# Altium schematic sheet Main.SchDoc
size A4; SheetNumber: 1; SheetTotal: 3
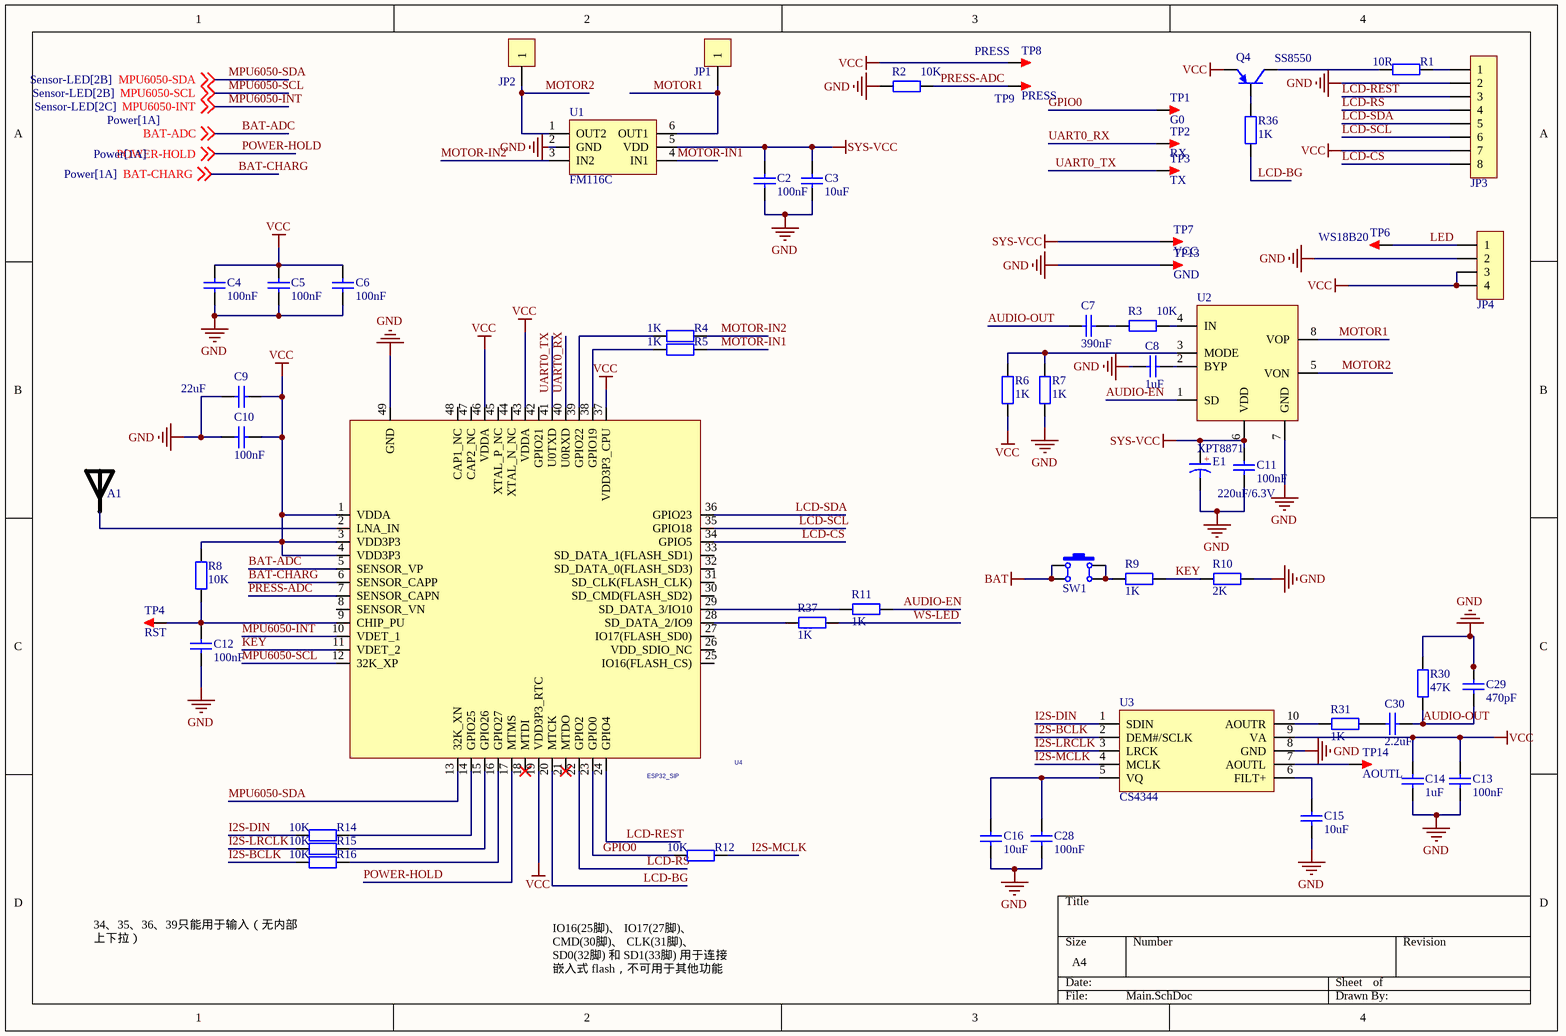
[diagram p0: Main.SchDoc]

## Parts
A1  RAINSUN  [ANT-Rainsun-AN5120]  (value not drawn)
C2  100nF  [C0402_M]
C3  10uF  [C0402_M]
C4  100nF  [C0402_M]
C5  100nF  [C0402_M]
C6  100nF  [C0402_M]
C7  390nF  [C0402_M]
C8  1uF  [C0402_M]
C9  22uF  [C0402_M]
C10  100nF  [C0402_M]
C11  100nF  [C0402_M]
C12  100nF  [C0402_M]
C13  100nF  [C0402_M]
C14  1uF  [C0402_M]
C15  10uF  [C0402_M]
C16  10uF  [C0402_M]
C28  100nF  [C0402_M]
C29  470pF  [C0402_M]
C30  2.2uF  [C0402_M]
E1  220uF/6.3V  [C_3528]
JP1  HDR-1x1  [HDR2.54-LI-1P]  (value not drawn)
JP2  HDR-1x1  [HDR2.54-LI-1P]  (value not drawn)
JP3  CON-8P  [FPC0.5-WT-8P-H1.0]  (value not drawn)
JP4  CON-4P  [FPC0.5-WT-4P-H1.0]  (value not drawn)
Q4  SS8550  [SOT23-3N]
R1  10R  [R0402_M]
R2  10K  [R0402_M]
R3  10K  [R0402_M]
R4  1K  [R0402_M]
R5  1K  [R0402_M]
R6  1K  [R0402_M]
R7  1K  [R0402_M]
R8  10K  [R0402_M]
R9  1K  [R0402_M]
R10  2K  [R0402_M]
R11  1K  [R0402_M]
R12  10K  [R0402_M]
R14  10K  [R0402_M]
R15  10K  [R0402_M]
R16  10K  [R0402_M]
R30  47K  [R0402_M]
R31  1K  [R0402_M]
R36  1K  [R0402_M]
R37  1K  [R0402_M]
SW1  4x4x1.5  [SW SMD-4*4*1.5]  (value not drawn)
TP1  G0  [TEST 1.2]
TP2  RX  [TEST 1.2]
TP3  TX  [TEST 1.2]
TP4  RST  [TEST 1.2]
TP6  WS18B20  [TEST 1.2]
TP7  VCC  [TEST 1.2]
TP8  PRESS  [TEST 1.2]
TP9  PRESS  [TEST 1.2]
TP13  GND  [TEST 1.2]
TP14  AOUTL  [TEST 1.2]
U1  FM116C  [SOT23-6]
U2  XPT8871  [ESOP8_L]
U3  CS4344  [TSSOP-10_L3.0-W3.0-P0.50-LS4.9-BL]
U4  ESP32_SIP  [QFN48 7X7_N]

## Nets
BAT: SW1.1 SW1.4
GND: C2.2 C3.2 C4.2 C5.2 C6.2 C8.2 C9.2 C10.2 C11.2 C12.1 C13.1 C14.1 C15.2 C16.2 C28.2 C29.1 E1.2(K) JP3.2 JP4.2 R2.1 R7.2 R10.2 R30.1 TP13.1 U1.2(GND) U2.7(GND) U3.8(GND) U4.49(GND)
SYS-VCC: C2.1 C3.1 C11.1 E1.1(A) TP7.1 U1.5(VDD) U2.6(VDD)
VCC: C4.1 C5.1 C6.1 C9.1 C10.1 C13.2 C14.2 JP3.7 JP4.3 JP4.4 Q4.2(E) R6.2 R8.2 TP8.1 U3.9(VA) U4.1(VDDA) U4.3(VDD3P3) U4.4(VDD3P3) U4.19(VDD3P3_RTC) U4.37(VDD3P3_CPU) U4.43(VDDA) U4.46(VDDA)
AUDIO-EN: R11.2 U2.1(SD)
AUDIO-OUT: C7.2 C29.2 C30.2 R30.2
BAT-ADC: U4.5(SENSOR_VP) ; off-sheet BAT-ADC
BAT-CHARG: U4.6(SENSOR_CAPP) ; off-sheet BAT-CHARG
GPIO0: R12.2 TP1.1 U4.23(GPIO0)
I2S-BCLK: R16.2 U3.2(DEM#/SCLK)
I2S-DIN: R14.2 U3.1(SDIN)
I2S-LRCLK: R15.2 U3.3(LRCK)
I2S-MCLK: R12.1 U3.4(MCLK)
KEY: R9.2 R10.1 U4.11(VDET_2)
LCD-BG: R36.2 U4.20(MTCK)
LCD-CS: JP3.8 U4.34(GPIO5)
LCD-REST: JP3.3 U4.24(GPIO4)
LCD-RS: JP3.4 U4.22(GPIO2)
LCD-SCL: JP3.6 U4.35(GPIO18)
LCD-SDA: JP3.5 U4.36(GPIO23)
LED: JP4.1 TP6.1
MOTOR1: JP1.1 U1.6(OUT1) U2.8(VOP)
MOTOR2: JP2.1 U1.1(OUT2) U2.5(VON)
MOTOR-IN1: R5.1 U1.4(IN1)
MOTOR-IN2: R4.1 U1.3(IN2)
MPU6050-INT: U4.10(VDET_1) ; off-sheet MPU6050-INT
MPU6050-SCL: U4.12(32K_XP) ; off-sheet MPU6050-SCL
MPU6050-SDA: U4.13(32K_XN) ; off-sheet MPU6050-SDA
POWER-HOLD: U4.17(MTMS) ; off-sheet POWER-HOLD
PRESS-ADC: R2.2 TP9.1 U4.7(SENSOR_CAPN)
UART0_RX: TP2.1 U4.40(U0RXD)
UART0_TX: TP3.1 U4.41(U0TXD)
WS-LED: R37.2
NetA1_1: A1.1 U4.2(LNA_IN)
NetC7_1: C7.1 R3.1
NetC8_1: C8.1 U2.2(BYP)
NetC12_2: C12.2 R8.1 TP4.1 U4.9(CHIP_PU)
NetC15_1: C15.1 U3.6(FILT+)
NetC16_1: C16.1 C28.1 U3.5(VQ)
NetC30_1: C30.1 R31.2
NetJP3_1: JP3.1 R1.1
NetQ4_1: Q4.1(B) R36.1
NetQ4_3: Q4.3(C) R1.2
NetR3_2: R3.2 U2.4(IN)
NetR4_2: R4.2 U4.39(GPIO22)
NetR5_2: R5.2 U4.38(GPIO19)
NetR6_1: R6.1 R7.1 U2.3(MODE)
NetR9_1: R9.1 SW1.2 SW1.3
NetR11_1: R11.1 U4.29(SD_DATA_3/IO10)
NetR14_1: R14.1 U4.14(GPIO25)
NetR15_1: R15.1 U4.15(GPIO26)
NetR16_1: R16.1 U4.16(GPIO27)
NetR31_1: R31.1 U3.10(AOUTR)
NetR37_1: R37.1 U4.28(SD_DATA_2/IO9)
NetTP14_1: TP14.1 U3.7(AOUTL)

Not connected (* = marked no-connect by the designer): U4 8(SENSOR_VN) 18(MTDI)* 21(MTDO)* 25(IO16(FLASH_CS)) 26(VDD_SDIO_NC) 27(IO17(FLASH_SD0)) 30(SD_CMD(FLASH_SD2)) 31(SD_CLK(FLASH_CLK)) 32(SD_DATA_0(FLASH_SD3)) 33(SD_DATA_1(FLASH_SD1)) 42(GPIO21) 44(XTAL_N_NC) 45(XTAL_P_NC) 47(CAP2_NC) 48(CAP1_NC)

## Notes on the sheet
- 34、35、36、39只能用于输入（无内部上下拉）
- IO16(25脚)、 IO17(27脚)、 CMD(30脚)、 CLK(31脚)、 SD0(32脚) 和 SD1(33脚) 用于连接嵌入式 flash，不可用于其他功能
- (in symbol CT) +

## Library data of the parts
A1 = ANT-Rainsun-AP5120
C2-C16 C28-C30 = C: 贴片电容/MLCC电容; BOM名称: 无极性贴片电容; 联系下单店铺卖家 免费帮你查找封装: 联系下单店铺卖家 免费技术支持
E1 = CT: 贴片钽电容; 联系下单店铺卖家 免费帮你查找封装: 联系下单店铺卖家 免费技术支持; BOM名称: 贴片钽电容
JP1 JP2 = Header 1: 1P接插件; BOM名称: 2P接插件; 联系卖家，免费查找封装: 唯一出售店铺网址https://shop463601444.taobao.com; 封装库来自淘宝卖家ID：黄晶宝石: 其他店铺购入均为盗版封装库，请立即申请退款，本店现金奖励50~200元
JP3 = Header 8: 8P连接器; 封装库来自淘宝卖家ID：黄晶宝石: 唯一出售店铺网址https://shop463601444.taobao.com; 联系卖家 免费查找封装: 封装库来自淘宝卖家ID：黄晶宝石; BOM名称: 8P连接器; 联系卖家 免费技术支持: 封装库来自淘宝卖家ID：黄晶宝石
JP4 = Header 4: 4P连接器; 封装库来自淘宝卖家ID：黄晶宝石: 唯一出售店铺网址https://shop463601444.taobao.com; 联系卖家 免费查找封装: 封装库来自淘宝卖家ID：黄晶宝石; BOM名称: 4P连接器; 联系卖家 免费技术支持: 封装库来自淘宝卖家ID：黄晶宝石
Q4 = 8550-SMD: 高频放大-PNP型; 参数: 40V 1.5A 1W 100MHZ; 8元以下特价购入的买家: 还可以联系卖家远程指导AD软件使用; BOM名称: 高频放大-PNP型
R1-R12 R14-R16 R30 R31 R36 R37 = R: 贴片电阻; 联系下单店铺卖家 免费帮你查找封装: 联系下单店铺卖家 免费技术支持; BOM名称: 贴片电阻
SW1 = SW SMD-4x4: 贴片4x4轻触开关; 联系卖家，免费查找封装: 唯一出售店铺网址https://shop463601444.taobao.com; 封装库来自淘宝卖家：黄晶宝石: 其他店铺购入均为盗版封装库，请立即申请退款，本店现金奖励200~1000元; BOM名称: 贴片4x4轻触开关
TP1-TP4 TP6-TP9 TP13 TP14 = TEST: 测试点; 联系卖家，免费查找封装: 唯一出售店铺网址https://shop463601444.taobao.com; 封装库来自淘宝卖家：黄晶宝石: 其他店铺购入均为盗版封装库，请立即申请退款，本店现金奖励200~1000元; BOM名称: 测试点
U1 = FM116C: 电机驱动芯片
U2 = XPT8871: A/B/D类功放
U3 = CS4344: 10-Pin, 24-Bit, 192 kHz Stereo D/A Converter
U4 = ESP32-PICO: ESP32 PICO